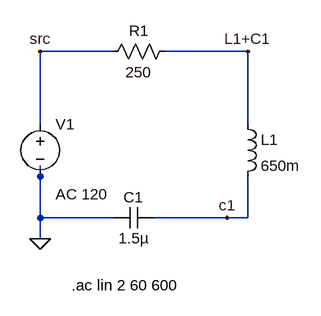
[diagram p0: schematic seri RLC.asc]
seri RLC.asc, the LTspice schematic file:
Version 4
SHEET 1 880 680
WIRE 336 -144 224 -144
WIRE 544 -144 416 -144
WIRE 224 -32 224 -144
WIRE 544 -32 544 -144
WIRE 224 48 224 32
WIRE 224 112 224 48
WIRE 336 112 224 112
WIRE 512 112 400 112
WIRE 544 112 544 48
WIRE 544 112 512 112
WIRE 224 144 224 112
FLAG 224 144 0
FLAG 224 -144 src
FLAG 544 -144 L1+C1
FLAG 512 112 c1
SYMBOL voltage 224 -48 R0
WINDOW 123 24 124 Left 2
WINDOW 39 0 0 Left 0
SYMATTR InstName V1
SYMATTR Value ""
SYMATTR Value2 AC 120
SYMBOL res 432 -160 R90
WINDOW 0 0 56 VBottom 2
WINDOW 3 32 56 VTop 2
SYMATTR InstName R1
SYMATTR Value 250
SYMBOL cap 400 96 R90
WINDOW 0 0 32 VBottom 2
WINDOW 3 32 32 VTop 2
SYMATTR InstName C1
SYMATTR Value 1.5µ
SYMBOL ind 528 -48 R0
SYMATTR InstName L1
SYMATTR Value 650m
TEXT 272 216 Left 2 !.ac lin 2 60 600

The netlist it stands for:
* seri RLC.asc
V1 src 0 AC 120
R1 L1+C1 src 250
C1 c1 0 1.5µ
L1 L1+C1 c1 650m
.ac lin 2 60 600
.backanno
.end